# EasyEDA schematic AccelCircuit_Schematic.json
TITLE: Sheet_1; REV: 1.0; Date: 2024-09-17; Sheet: 1/1; Drawn By: group7_9801; Company: Your Company
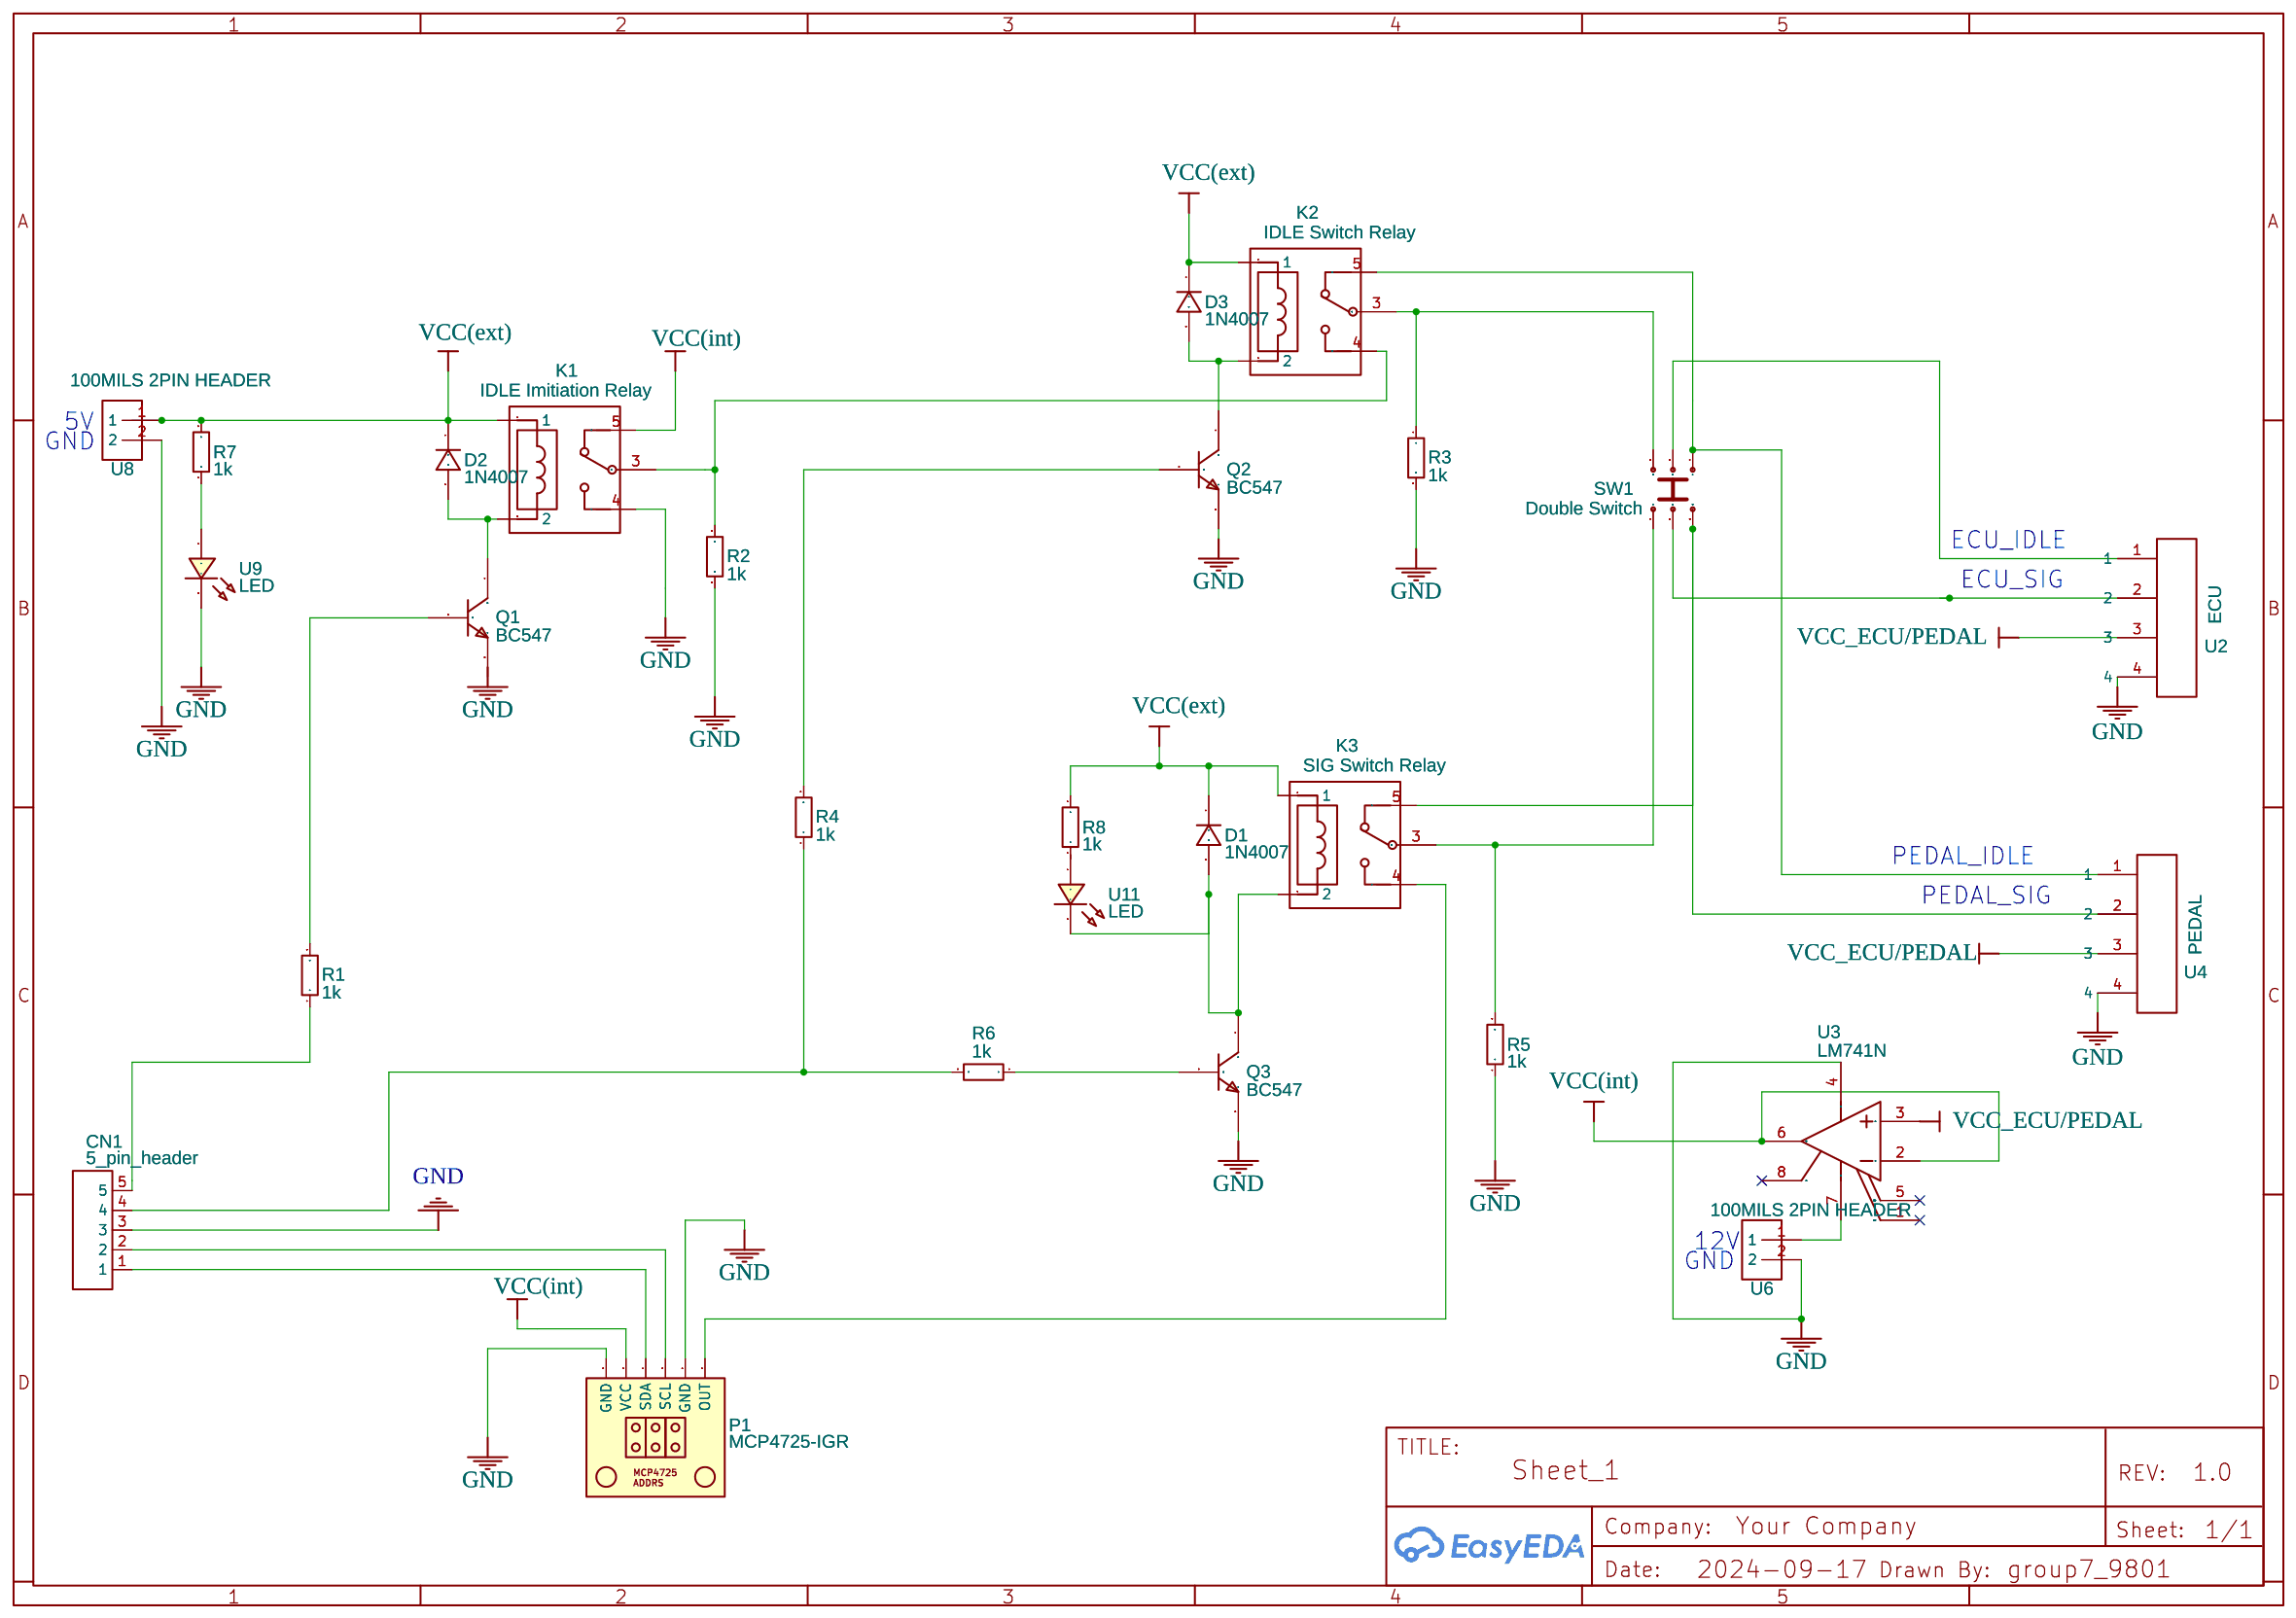
[diagram p0: schematic sheet]

## Parts
CN1  5_pin_header  [5_PIN_HEADER]
D1  1N4007  [DO-41_BD2.4-L4.7-P8.70-D0.9-RD]
D2  1N4007  [DO-41_BD2.4-L4.7-P8.70-D0.9-RD]
D3  1N4007  [DO-41_BD2.4-L4.7-P8.70-D0.9-RD]
K1  IDLE Imitiation Relay  [HRS4H-S-5V]
K2  IDLE Switch Relay  [HRS4H-S-5V]
K3  SIG Switch Relay  [HRS4H-S-5V]
P1  MCP4725-IGR  [MCP4725]
Q1  BC547  [BC547]
Q2  BC547  [BC547]
Q3  BC547  [BC547]
R1  1k  [RESISTOR]
R2  1k  [RESISTOR]
R3  1k  [RESISTOR]
R4  1k  [RESISTOR]
R5  1k  [RESISTOR]
R6  1k  [RESISTOR]
R7  1k  [RESISTOR]
R8  1k  [RESISTOR]
SW1  Double Switch  [6A125VAC BLUE SWITCH DPDT 6 PIN CORRECT]
U2  ECU  [4_PIN_HEADER_100MILS]
U3  LM741N  [DIP-8_L9.3-W6.4-P2.54-LS7.6-BL]
U4  PEDAL  [4_PIN_HEADER_100MILS]
U6  100MILS 2PIN HEADER  [100MILS 2PIN HEADER]
U8  100MILS 2PIN HEADER  [100MILS 2PIN HEADER]
U9  LED  [LED-TH_L5..8-W5.6-P2.54_32LED-RED]
U11  LED  [LED-TH_L5..8-W5.6-P2.54_32LED-RED]

## Library data of the parts
CN1 = 5_pin_header: Contributor: ekhan; Supplier Part: C293640; Manufacturer: MOLEX; Manufacturer Part: 559320510; JLCPCB Part Class: Extended Part
D1-D3 = 1N4007: Supplier: LCSC; Manufacturer: SEMTECH; Supplier Part: C106903; Contributor: LCEDA_Lib
K1-K3 = HRS4H-S-5V RELAY: Supplier: LCSC; Supplier Part: C559408; link: https://atta.szlcsc.comnull; Contributor: test0071
P1 = MCP4725-IGR: sourceId: 1T5FDZYC8; Contributor: igrozavescu
Q1-Q3 = BC547: Contributor: Suraj Prabhakaran
R1-R8 = RESISTOR NORMAL: Supplier: LCSC; Supplier Part: X16151710; Manufacturer: ResistorToday; Manufacturer Part: EWWR0001J20R0T9; Contributor: MehmetCan94
SW1 = Double_Switch_2Pos: Supplier: LCSC; Supplier Part: C136722; Manufacturer: Rectangular Connectors - Contacts; Manufacturer Part: SK-12D02-VG5; Contributor: Vazgen; JLCPCB Part Class: Extended Part
U2 U4 = 200mils_4Pin_Header: Contributor: zeeshan_nafees_ahmed_hu
U3 = LM741N: Supplier: LCSC; Supplier Part: C22446595; Manufacturer: HGSEMI(华冠); Contributor: lcsc; JLCPCB Part Class: Extended Part
U6 U8 = 100MILS 2PIN HEADER: catid: 20; Contributor: Argulab; sim: true
U9 U11 = 32LED-RED: Supplier: LCSC; Supplier Part: C3306983; Manufacturer: Grayhill; JLCPCB Part Class: Extended Part; Contributor: lcsc

## Nets
GND: CN1.3 K1.4 P1.2(GND) P1.6(GND) Q1.3(E) Q2.3(E) Q3.3(E) R2.2 R3.2 R5.1 U2.4 U3.4(V-) U4.4 U6.2 U8.2 U9.2(-)
VCC(ext): D1.1 D2.1 D3.1 K1.1 K2.1 K3.1 R7.2 R8.2 U8.1
VCC(int): K1.5 P1.5(VCC) U3.2(-IN) U3.6(OUT)
VCC_ECU/PEDAL: U2.3 U3.3(+IN) U4.3
Net-(CN1-1): CN1.1 P1.4(SDA)
Net-(CN1-2): CN1.2 P1.3(SCL)
Net-(CN1-4): CN1.4 R4.1 R6.2
Net-(CN1-5): CN1.5 R1.1
Net-(D1-2): D1.2 K3.2 Q3.1(C) U11.2(-)
Net-(D2-2): D2.2 K1.2 Q1.1(C)
Net-(D3-2): D3.2 K2.2 Q2.1(C)
Net-(K1-3): K1.3 K2.4 R2.1
Net-(K2-3): K2.3 R3.1 SW1.3
Net-(K2-5): K2.5 SW1.1 U4.1
Net-(K3-3): K3.3 R5.2 SW1.4
Net-(K3-4): K3.4 P1.1(OUT)
Net-(K3-5): K3.5 SW1.6 U4.2
Net-(Q1-2): Q1.2(B) R1.2
Net-(Q2-2): Q2.2(B) R4.2
Net-(Q3-2): Q3.2(B) R6.1
Net-(R7-1): R7.1 U9.1(+)
Net-(R8-1): R8.1 U11.1(+)
Net-(SW1-2): SW1.2 U2.1
Net-(SW1-5): SW1.5 U2.2
Net-(U3-7): U3.7(V+) U6.1

Not connected (* = marked no-connect by the designer): U3 1(OFFSET NULL)* 5(OFFSET NULL)* 8(NC)*

## Notes on the sheet
- 5V
- GND
- ECU_IDLE
- ECU_SIG
- PEDAL_IDLE
- PEDAL_SIG
- 12V
- GND
